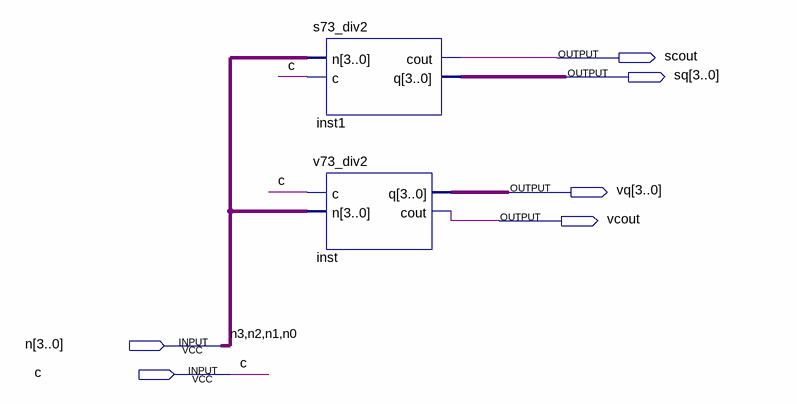
[diagram p0: schematic sheet]
// Quartus schematic sv73_div2.bdf as structural Verilog: 2 symbols, 6 pins
module sv73_div2 (
  input  [3:0] n,
  input  c,
  output scout,
  output [3:0] sq,
  output [3:0] vq,
  output vcout
);

  s73_div2 inst1 (.n(n), .c(c), .cout(scout), .q(sq));
  v73_div2 inst (.c(c), .n(n), .q(vq), .cout(vcout));
endmodule
